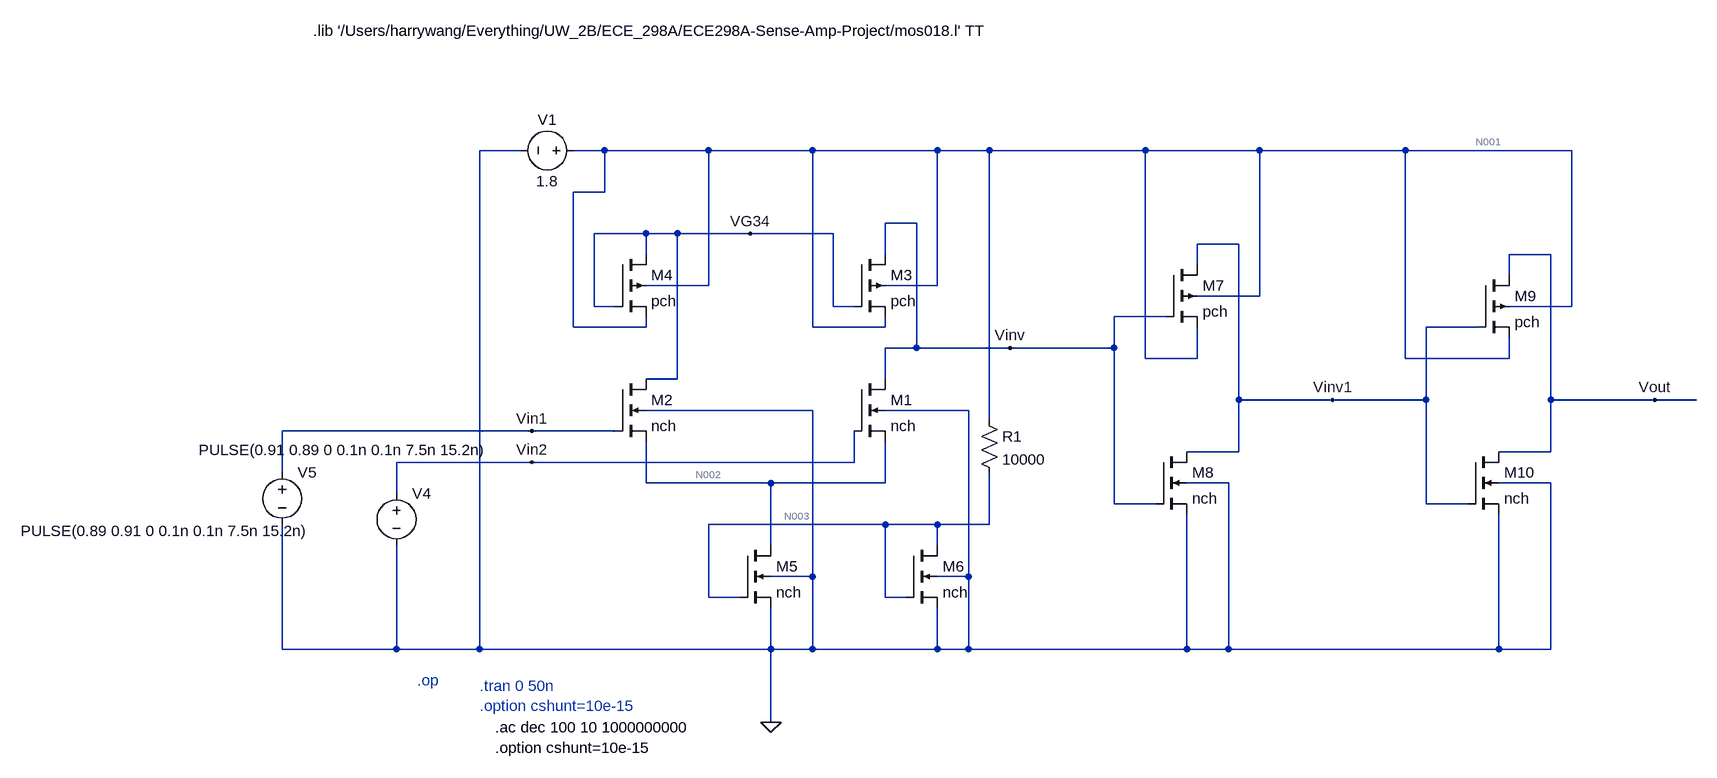
[diagram p0: schematic Sense_amp_alternate.asc]
Sense_amp_alternate.asc, the LTspice schematic file:
Version 4
SHEET 1 1684 688
WIRE -128 -256 -192 -256
WIRE 0 -256 -48 -256
WIRE 160 -256 0 -256
WIRE 320 -256 160 -256
WIRE 512 -256 320 -256
WIRE 592 -256 512 -256
WIRE 832 -256 592 -256
WIRE 1008 -256 832 -256
WIRE 1232 -256 1008 -256
WIRE 1488 -256 1232 -256
WIRE 0 -192 0 -256
WIRE 0 -192 -48 -192
WIRE 480 -144 432 -144
WIRE 64 -128 -16 -128
WIRE 112 -128 64 -128
WIRE 224 -128 112 -128
WIRE 352 -128 224 -128
WIRE 976 -112 912 -112
WIRE 64 -96 64 -128
WIRE 432 -96 432 -144
WIRE 1456 -96 1392 -96
WIRE 912 -80 912 -112
WIRE 1392 -64 1392 -96
WIRE 160 -48 160 -256
WIRE 160 -48 64 -48
WIRE 512 -48 512 -256
WIRE 512 -48 432 -48
WIRE 1008 -32 1008 -256
WIRE 1008 -32 912 -32
WIRE -16 -16 -16 -128
WIRE 16 -16 -16 -16
WIRE 352 -16 352 -128
WIRE 384 -16 352 -16
WIRE 1488 -16 1488 -256
WIRE 1488 -16 1392 -16
WIRE 864 0 784 0
WIRE -48 16 -48 -192
WIRE 64 16 64 0
WIRE 64 16 -48 16
WIRE 320 16 320 -256
WIRE 432 16 432 0
WIRE 432 16 320 16
WIRE 1344 16 1264 16
WIRE 480 48 480 -144
WIRE 480 48 432 48
WIRE 624 48 480 48
WIRE 784 48 784 0
WIRE 784 48 624 48
WIRE 832 64 832 -256
WIRE 912 64 912 16
WIRE 912 64 832 64
WIRE 1232 64 1232 -256
WIRE 1392 64 1392 32
WIRE 1392 64 1232 64
WIRE 112 96 112 -128
WIRE 112 96 64 96
WIRE 432 96 432 48
WIRE 976 128 976 -112
WIRE 1120 128 976 128
WIRE 1264 128 1264 16
WIRE 1264 128 1120 128
WIRE 1456 128 1456 -96
WIRE 1616 128 1456 128
WIRE 1680 128 1616 128
WIRE 320 144 64 144
WIRE 560 144 432 144
WIRE 592 160 592 -256
WIRE -112 176 -496 176
WIRE 16 176 -112 176
WIRE 976 208 976 128
WIRE 976 208 896 208
WIRE 1456 208 1456 128
WIRE 1456 208 1376 208
WIRE -112 224 -320 224
WIRE 384 224 384 176
WIRE 384 224 -112 224
WIRE -496 240 -496 176
WIRE 64 256 64 192
WIRE 256 256 64 256
WIRE 432 256 432 192
WIRE 432 256 256 256
WIRE 960 256 896 256
WIRE 1456 256 1376 256
WIRE -320 272 -320 224
WIRE 784 288 784 48
WIRE 848 288 784 288
WIRE 1264 288 1264 128
WIRE 1328 288 1264 288
WIRE 432 320 160 320
WIRE 512 320 432 320
WIRE 592 320 592 240
WIRE 592 320 512 320
WIRE 256 352 256 256
WIRE 512 352 512 320
WIRE 320 400 320 144
WIRE 320 400 256 400
WIRE 560 400 560 144
WIRE 560 400 512 400
WIRE 160 432 160 320
WIRE 208 432 160 432
WIRE 432 432 432 320
WIRE 464 432 432 432
WIRE -496 512 -496 320
WIRE -320 512 -320 352
WIRE -320 512 -496 512
WIRE -192 512 -192 -256
WIRE -192 512 -320 512
WIRE 256 512 256 448
WIRE 256 512 -192 512
WIRE 320 512 320 400
WIRE 320 512 256 512
WIRE 512 512 512 448
WIRE 512 512 320 512
WIRE 560 512 560 400
WIRE 560 512 512 512
WIRE 896 512 896 304
WIRE 896 512 560 512
WIRE 960 512 960 256
WIRE 960 512 896 512
WIRE 1376 512 1376 304
WIRE 1376 512 960 512
WIRE 1456 512 1456 256
WIRE 1456 512 1376 512
WIRE 256 624 256 512
FLAG 624 48 Vinv
FLAG -112 176 Vin1
FLAG -112 224 Vin2
FLAG 224 -128 VG34
FLAG 256 624 0
FLAG 1120 128 Vinv1
FLAG 1616 128 Vout
SYMBOL voltage -32 -256 R90
WINDOW 0 -32 56 VBottom 2
WINDOW 3 32 56 VTop 2
WINDOW 123 0 0 Left 0
WINDOW 39 0 0 Left 0
SYMATTR InstName V1
SYMATTR Value 1.8
SYMBOL pmos4 384 -96 R0
SYMATTR InstName M3
SYMATTR Value pch
SYMATTR Value2 l=0.18e-6 w=1.0e-6
SYMBOL pmos4 16 -96 R0
SYMATTR InstName M4
SYMATTR Value pch
SYMATTR Value2 l=0.18e-6 w=1.0e-6
SYMBOL nmos4 384 96 R0
SYMATTR InstName M1
SYMATTR Value nch
SYMATTR Value2 l=0.18e-6 w=1.2e-6
SYMBOL nmos4 16 96 R0
SYMATTR InstName M2
SYMATTR Value nch
SYMATTR Value2 l=0.18e-6 w=1.2e-6
SYMBOL nmos4 208 352 R0
SYMATTR InstName M5
SYMATTR Value nch
SYMATTR Value2 l=0.18e-6 w=0.7e-6
SYMBOL voltage -320 256 R0
WINDOW 3 -304 -51 Left 2
SYMATTR Value PULSE(0.91 0.89 0 0.1n 0.1n 7.5n 15.2n)
SYMATTR InstName V4
SYMBOL voltage -496 224 R0
WINDOW 3 -402 106 Left 2
SYMATTR Value PULSE(0.89 0.91 0 0.1n 0.1n 7.5n 15.2n)
SYMATTR InstName V5
SYMATTR Value2 AC 0.1
SYMBOL nmos4 464 352 R0
SYMATTR InstName M6
SYMATTR Value nch
SYMATTR Value2 l=0.18e-6 w=0.7e-6
SYMBOL res 576 144 R0
SYMATTR InstName R1
SYMATTR Value 10000
SYMBOL pmos4 864 -80 R0
SYMATTR InstName M7
SYMATTR Value pch
SYMATTR Value2 l=0.18e-6 w=1.0e-6
SYMBOL nmos4 848 208 R0
SYMATTR InstName M8
SYMATTR Value nch
SYMATTR Value2 l=0.18e-6 w=2.0e-6
SYMBOL pmos4 1344 -64 R0
SYMATTR InstName M9
SYMATTR Value pch
SYMATTR Value2 l=0.18e-6 w=2.0e-6
SYMBOL nmos4 1328 208 R0
SYMATTR InstName M10
SYMATTR Value nch
SYMATTR Value2 l=0.18e-6 w=1.0e-6
TEXT -192 568 Left 2 ;.tran 0 50n\n.option cshunt=10e-15
TEXT -168 632 Left 2 !.ac dec 100 10 1000000000\n.option cshunt=10e-15
TEXT -448 -440 Left 2 !.lib '/Users/harrywang/Everything/UW_2B/ECE_298A/ECE298A-Sense-Amp-Project/mos018.l' TT
TEXT -288 560 Left 2 ;.op

The netlist it stands for:
* Sense_amp_alternate.asc
V1 N001 0 1.8
M3 Vinv VG34 N001 N001 pch l=0.18e-6 w=1.0e-6
M4 VG34 VG34 N001 N001 pch l=0.18e-6 w=1.0e-6
M1 Vinv Vin2 N002 0 nch l=0.18e-6 w=1.2e-6
M2 VG34 Vin1 N002 0 nch l=0.18e-6 w=1.2e-6
M5 N002 N003 0 0 nch l=0.18e-6 w=0.7e-6
V4 Vin2 0 PULSE(0.91 0.89 0 0.1n 0.1n 7.5n 15.2n)
V5 Vin1 0 PULSE(0.89 0.91 0 0.1n 0.1n 7.5n 15.2n) AC 0.1
M6 N003 N003 0 0 nch l=0.18e-6 w=0.7e-6
R1 N001 N003 10000
M7 Vinv1 Vinv N001 N001 pch l=0.18e-6 w=1.0e-6
M8 Vinv1 Vinv 0 0 nch l=0.18e-6 w=2.0e-6
M9 Vout Vinv1 N001 N001 pch l=0.18e-6 w=2.0e-6
M10 Vout Vinv1 0 0 nch l=0.18e-6 w=1.0e-6
.model NMOS NMOS
.model PMOS PMOS
.lib standard.mos
* .tran 0 50n
* .option cshunt=10e-15
.ac dec 100 10 1000000000
.option cshunt=10e-15
.lib '/Users/harrywang/Everything/UW_2B/ECE_298A/ECE298A-Sense-Amp-Project/mos018.l' TT
* .op
.backanno
.end

* Results of the author's LTspice run, read from the files saved beside the schematic
* Operating Point, zero values left out:
*   V(n001) = 1.8 V
*   V(vinv) = 516.8 mV
*   V(vg34) = 905.9 mV
*   V(vin2) = 910 mV
*   V(n002) = 187.6 mV
*   V(vin1) = 890 mV
*   V(n003) = 894.2 mV
*   V(vinv1) = 1.746 V
*   V(vout) = 12.04 nV
*   Id(M3) = -32.25 µA
*   Ib(M3) = 1.309 pA
*   Is(M3) = 32.25 µA
*   Id(M4) = -30.61 µA
*   Is(M4) = 30.61 µA
*   Id(M7) = -12.71 µA
*   Is(M7) = 12.71 µA
*   Id(M1) = 32.25 µA
*   Is(M1) = -32.25 µA
*   Id(M2) = 30.61 µA
*   Ib(M2) = -1.143 pA
*   Is(M2) = -30.61 µA
*   Id(M5) = 62.86 µA
*   Is(M5) = -62.86 µA
*   Id(M6) = 90.58 µA
*   Ib(M6) = -1.513 pA
*   Is(M6) = -90.58 µA
*   Id(M10) = 20.5 pA
*   Is(M10) = -20.5 pA
*   Id(M8) = 12.71 µA
*   Ib(M8) = -9.569 nA
*   Is(M8) = -12.7 µA
*   Id(M9) = -20.5 pA
*   Ib(M9) = 1.811 pA
*   Is(M9) = 18.69 pA
*   I(R1) = 90.58 µA
*   I(V1) = -166.1 µA
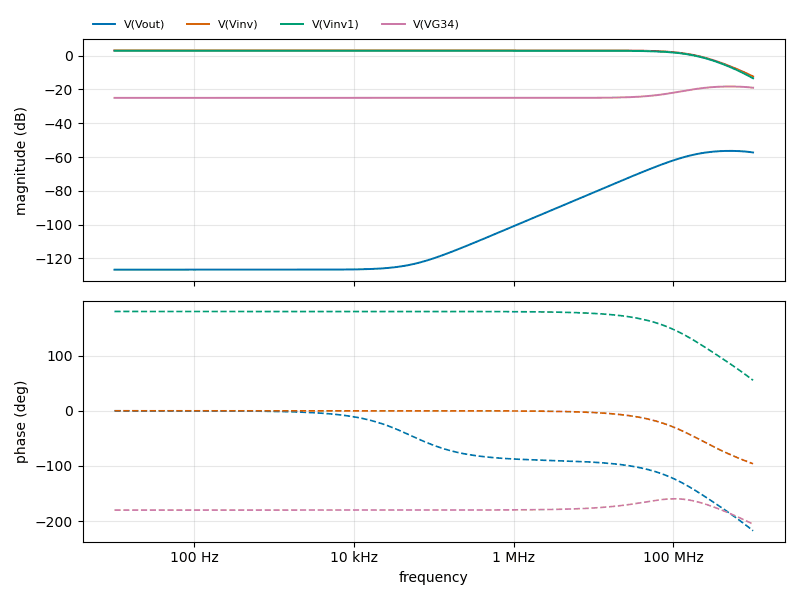
[diagram p1: AC Analysis of Sense_amp_alternate.asc, plotted from the saved traces]
* AC Analysis, 1 run:
*   V(Vout): -126.67 dB at 10 Hz, -57.29 dB at 1 GHz, peak -56.36 dB at 512.9 MHz, 3 dB below the peak at 154.4 MHz
*   V(Vinv): 3.09 dB at 10 Hz, -12.32 dB at 1 GHz, peak 3.09 dB at 10 Hz, 3 dB below the peak at 191.6 MHz
*   V(Vinv1): 2.90 dB at 10 Hz, -13.42 dB at 1 GHz, peak 2.90 dB at 10 Hz, 3 dB below the peak at 190 MHz
*   V(VG34): -25.00 dB at 10 Hz, -18.98 dB at 1 GHz, peak -18.24 dB at 512.9 MHz, 3 dB below the peak at 121.8 MHz